# EAGLE design power_board2_v2.0 (EAGLE 9.5.1)
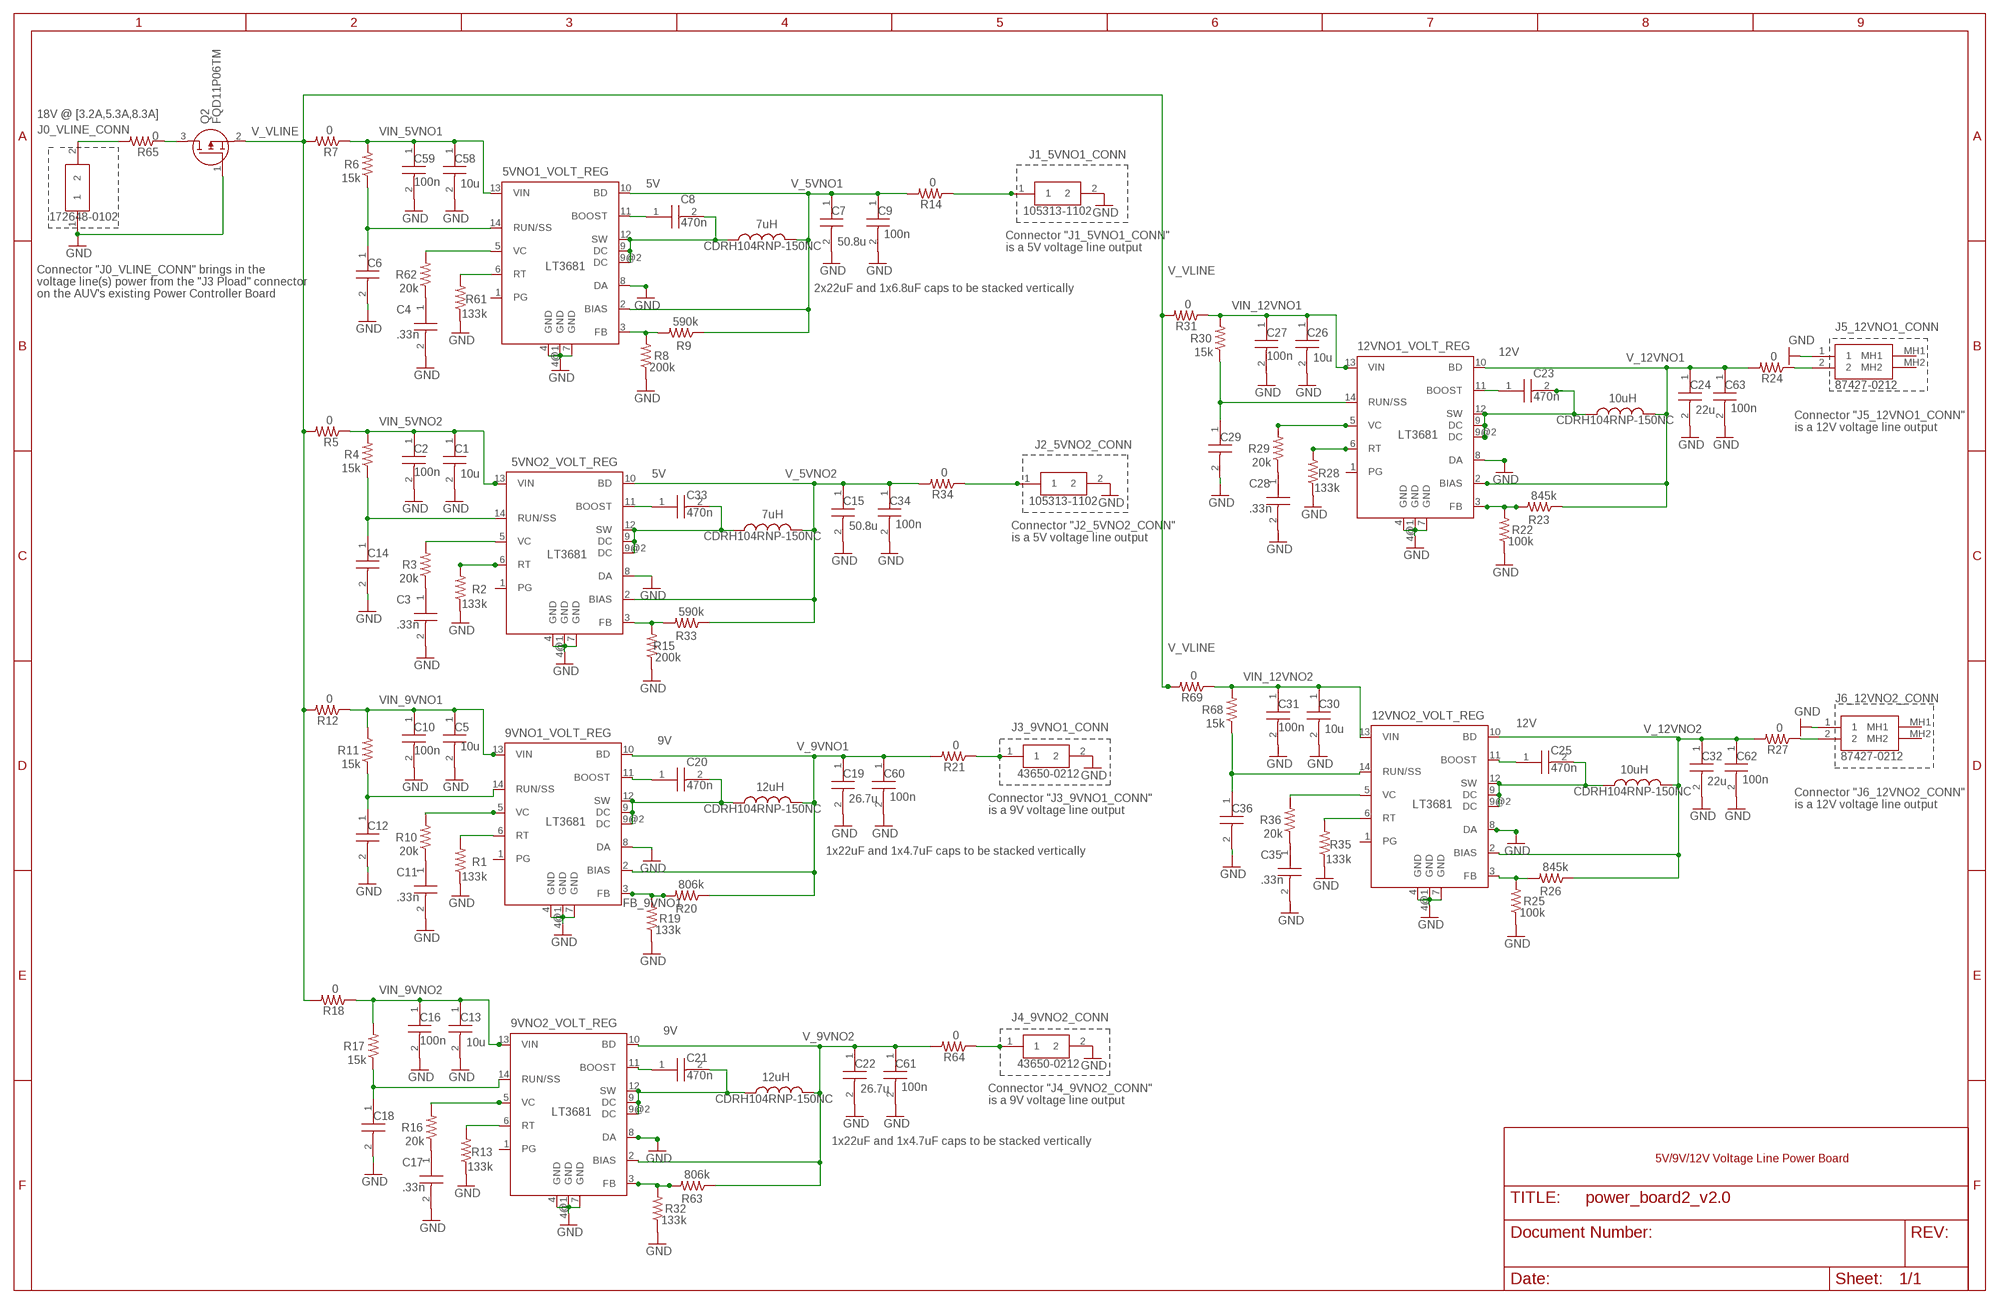
[diagram p0: schematic, sheet 1]

## Parts
5VNO1_VOLT_REG  LT3681  [DFN14-4X3DE]
5VNO2_VOLT_REG  LT3681  [DFN14-4X3DE]
9VNO1_VOLT_REG  LT3681  [DFN14-4X3DE]
9VNO2_VOLT_REG  LT3681  [DFN14-4X3DE]
12VNO1_VOLT_REG  LT3681  [DFN14-4X3DE]
12VNO2_VOLT_REG  LT3681  [DFN14-4X3DE]
C1  10u  22201C106KAT2A  [CAPC5750X279N]
C2  100n  06031C104KAT2A  [CAPC1608X90N]
C3  .33n  08053C334KAT2A  [CAPC2012X140N]
C4  .33n  08053C334KAT2A  [CAPC2012X140N]
C5  10u  22201C106KAT2A  [CAPC5750X279N]
C6  220n  08051C224KAT2A  [CAPC2012X140N]
C7  50.8u  12103C226KAT2A  [CAPC3225X279N]
C8  470n  06033C474JAT2A  [CAPC1608X90N]
C9  100n  06033C104KAT4A  [CAPC1608X90N]
C10  100n  06031C104KAT2A  [CAPC1608X90N]
C11  .33n  08053C334KAT2A  [CAPC2012X140N]
C12  220n  08051C224KAT2A  [CAPC2012X140N]
C13  10u  22201C106KAT2A  [CAPC5750X279N]
C14  220n  08051C224KAT2A  [CAPC2012X140N]
C15  50.8u  12103C226KAT2A  [CAPC3225X279N]
C16  100n  06031C104KAT2A  [CAPC1608X90N]
C17  .33n  08053C334KAT2A  [CAPC2012X140N]
C18  220n  08051C224KAT2A  [CAPC2012X140N]
C19  26.7u  12103C226KAT2A  [CAPC3225X279N]
C20  470n  06033C474JAT2A  [CAPC1608X90N]
C21  470n  06033C474JAT2A  [CAPC1608X90N]
C22  26.7u  12103C226KAT2A  [CAPC3225X279N]
C23  470n  06033C474JAT2A  [CAPC1608X90N]
C24  22u  12103C226KAT2A  [CAPC3225X279N]
C25  470n  06033C474JAT2A  [CAPC1608X90N]
C26  10u  22201C106KAT2A  [CAPC5750X279N]
C27  100n  06031C104KAT2A  [CAPC1608X90N]
C28  .33n  08053C334KAT2A  [CAPC2012X140N]
C29  220n  08051C224KAT2A  [CAPC2012X140N]
C30  10u  22201C106KAT2A  [CAPC5750X279N]
C31  100n  06031C104KAT2A  [CAPC1608X90N]
C32  22u  12103C226KAT2A  [CAPC3225X279N]
C33  470n  06033C474JAT2A  [CAPC1608X90N]
C34  100n  06033C104KAT4A  [CAPC1608X90N]
C35  .33n  08053C334KAT2A  [CAPC2012X140N]
C36  220n  08051C224KAT2A  [CAPC2012X140N]
C58  10u  22201C106KAT2A  [CAPC5750X279N]
C59  100n  06031C104KAT2A  [CAPC1608X90N]
C60  100n  06033C104KAT4A  [CAPC1608X90N]
C61  100n  06033C104KAT4A  [CAPC1608X90N]
C62  100n  06033C104KAT4A  [CAPC1608X90N]
C63  100n  06033C104KAT4A  [CAPC1608X90N]
INDUCTOR_2  CDRH104RNP-150NC  [INDPM102100X400N]
INDUCTOR_4  CDRH104RNP-150NC  [INDPM102100X400N]
INDUCTOR_5  CDRH104RNP-150NC  [INDPM102100X400N]
INDUCTOR_6  CDRH104RNP-150NC  [INDPM102100X400N]
INDUCTOR_7  CDRH104RNP-150NC  [INDPM102100X400N]
INDUCTOR_8  CDRH104RNP-150NC  [INDPM102100X400N]
J0_VLINE_CONN  172648-0102  [1726480102]
J1_5VNO1_CONN  105313-1102  [1053131102]
J2_5VNO2_CONN  105313-1102  [1053131102]
J3_9VNO1_CONN  43650-0212  [43650-0214]
J4_9VNO2_CONN  43650-0212  [43650-0214]
J5_12VNO1_CONN  87427-0212  [874270212]
J6_12VNO2_CONN  87427-0212  [874270212]
Q2  FQD11P06TM  [DPAK3-CASE-369AS]
R1  133k  R-US_R0603  [R0603]
R2  133k  R-US_R0603  [R0603]
R3  20k  R-US_R0603  [R0603]
R4  15k  R-US_R0603  [R0603]
R5  0  R-US_0207/2V  [0207/2V]
R6  15k  R-US_R0603  [R0603]
R7  0  R-US_0207/2V  [0207/2V]
R8  200k  R-US_R0603  [R0603]
R9  590k  R-US_R0603  [R0603]
R10  20k  R-US_R0603  [R0603]
R11  15k  R-US_R0603  [R0603]
R12  0  R-US_0207/2V  [0207/2V]
R13  133k  R-US_R0603  [R0603]
R14  0  R-US_0207/2V  [0207/2V]
R15  200k  R-US_R0603  [R0603]
R16  20k  R-US_R0603  [R0603]
R17  15k  R-US_R0603  [R0603]
R18  0  R-US_0207/2V  [0207/2V]
R19  133k  R-US_R0603  [R0603]
R20  806k  R-US_R0603  [R0603]
R21  0  R-US_0207/2V  [0207/2V]
R22  100k  R-US_R0603  [R0603]
R23  845k  R-US_R0603  [R0603]
R24  0  R-US_0207/2V  [0207/2V]
R25  100k  R-US_R0603  [R0603]
R26  845k  R-US_R0603  [R0603]
R27  0  R-US_0207/2V  [0207/2V]
R28  133k  R-US_R0603  [R0603]
R29  20k  R-US_R0603  [R0603]
R30  15k  R-US_R0603  [R0603]
R31  0  R-US_0207/2V  [0207/2V]
R32  133k  R-US_R0603  [R0603]
R33  590k  R-US_R0603  [R0603]
R34  0  R-US_0207/2V  [0207/2V]
R35  133k  R-US_R0603  [R0603]
R36  20k  R-US_R0603  [R0603]
R61  133k  R-US_R0603  [R0603]
R62  20k  R-US_R0603  [R0603]
R63  806k  R-US_R0603  [R0603]
R64  0  R-US_0207/2V  [0207/2V]
R65  0  R-US_0207/2V  [0207/2V]
R68  15k  R-US_R0603  [R0603]
R69  0  R-US_0207/2V  [0207/2V]

## Nets
CBOOST_5VNO1: 5VNO1_VOLT_REG.11(BOOST) C8.1
CBOOST_5VNO2: 5VNO2_VOLT_REG.11(BOOST) C33.1
CBOOST_9VNO1: 9VNO1_VOLT_REG.11(BOOST) C20.1
CBOOST_9VNO2: 9VNO2_VOLT_REG.11(BOOST) C21.1
CBOOST_12VNO1: 12VNO1_VOLT_REG.11(BOOST) C23.1
CBOOST_12VNO2: 12VNO2_VOLT_REG.11(BOOST) C25.1
FB_5VNO1: 5VNO1_VOLT_REG.3(FB) R8.2 R9.2
FB_5VNO2: 5VNO2_VOLT_REG.3(FB) R15.2 R33.2
FB_9VNO1: 9VNO1_VOLT_REG.3(FB) R19.2 R20.2
FB_9VNO2: 9VNO2_VOLT_REG.3(FB) R32.2 R63.2
FB_12VNO1: 12VNO1_VOLT_REG.3(FB) R22.2 R23.2
FB_12VNO2: 12VNO2_VOLT_REG.3(FB) R25.2 R26.2
GND: 5VNO1_VOLT_REG.4(GND) 5VNO1_VOLT_REG.4@1(GND) 5VNO1_VOLT_REG.7(GND) 5VNO1_VOLT_REG.8(DA) 5VNO2_VOLT_REG.4(GND) 5VNO2_VOLT_REG.4@1(GND) 5VNO2_VOLT_REG.7(GND) 5VNO2_VOLT_REG.8(DA) 9VNO1_VOLT_REG.4(GND) 9VNO1_VOLT_REG.4@1(GND) 9VNO1_VOLT_REG.7(GND) 9VNO1_VOLT_REG.8(DA) 9VNO2_VOLT_REG.4(GND) 9VNO2_VOLT_REG.4@1(GND) 9VNO2_VOLT_REG.7(GND) 9VNO2_VOLT_REG.8(DA) 12VNO1_VOLT_REG.4(GND) 12VNO1_VOLT_REG.4@1(GND) 12VNO1_VOLT_REG.7(GND) 12VNO1_VOLT_REG.8(DA) 12VNO2_VOLT_REG.4(GND) 12VNO2_VOLT_REG.4@1(GND) 12VNO2_VOLT_REG.7(GND) C1.2 C2.2 C3.2 C4.2 C5.2 C6.2 C7.2 C9.2 C10.2 C11.2 C12.2 C13.2 C14.2 C15.2 C16.2 C17.2 C18.2 C19.2 C22.2 C24.2 C26.2 C27.2 C28.2 C29.2 C30.2 C31.2 C32.2 C34.2 C35.2 C36.2 C58.2 C59.2 C60.2 C61.2 C62.2 C63.2 J0_VLINE_CONN.1 J1_5VNO1_CONN.2 J2_5VNO2_CONN.2 J3_9VNO1_CONN.2 J4_9VNO2_CONN.2 J5_12VNO1_CONN.1 J6_12VNO2_CONN.1 Q2.1(G) R1.1 R2.1 R8.1 R13.1 R15.1 R19.1 R22.1 R25.1 R28.1 R32.1 R35.1 R61.1
N$1: C4.1 R62.1
N$4: C3.1 R3.1
N$5: C11.1 R10.1
N$6: C17.1 R16.1
N$17: C28.1 R29.1
N$18: C35.1 R36.1
RT_5VNO1: 5VNO1_VOLT_REG.6(RT) R61.2
RT_5VNO2: 5VNO2_VOLT_REG.6(RT) R2.2
RT_9VNO1: 9VNO1_VOLT_REG.6(RT) R1.2
RT_9VNO2: 9VNO2_VOLT_REG.6(RT) R13.2
RT_12VNO1: 12VNO1_VOLT_REG.6(RT) R28.2
RT_12VNO2: 12VNO2_VOLT_REG.6(RT) R35.2
RUN/SS_5VNO1: 5VNO1_VOLT_REG.14(RUN/SS) C6.1 R6.1
RUN/SS_5VNO2: 5VNO2_VOLT_REG.14(RUN/SS) C14.1 R4.1
RUN/SS_9VNO1: 9VNO1_VOLT_REG.14(RUN/SS) C12.1 R11.1
RUN/SS_9VNO2: 9VNO2_VOLT_REG.14(RUN/SS) C18.1 R17.1
RUN/SS_12VNO1: 12VNO1_VOLT_REG.14(RUN/SS) C29.1 R30.1
RUN/SS_12VNO2: 12VNO2_VOLT_REG.14(RUN/SS) C36.1 R68.1
SW_5VNO1: 5VNO1_VOLT_REG.9(DC) 5VNO1_VOLT_REG.9@2(DC) 5VNO1_VOLT_REG.12(SW) C8.2 INDUCTOR_2.1
SW_5VNO2: 5VNO2_VOLT_REG.9(DC) 5VNO2_VOLT_REG.9@2(DC) 5VNO2_VOLT_REG.12(SW) C33.2 INDUCTOR_4.1
SW_9VNO1: 9VNO1_VOLT_REG.9(DC) 9VNO1_VOLT_REG.9@2(DC) 9VNO1_VOLT_REG.12(SW) C20.2 INDUCTOR_5.1
SW_9VNO2: 9VNO2_VOLT_REG.9(DC) 9VNO2_VOLT_REG.9@2(DC) 9VNO2_VOLT_REG.12(SW) C21.2 INDUCTOR_6.1
SW_12VNO1: 12VNO1_VOLT_REG.9(DC) 12VNO1_VOLT_REG.9@2(DC) 12VNO1_VOLT_REG.12(SW) C23.2 INDUCTOR_7.1
SW_12VNO2: 12VNO2_VOLT_REG.9(DC) 12VNO2_VOLT_REG.9@2(DC) 12VNO2_VOLT_REG.12(SW) C25.2 INDUCTOR_8.1
V_5VNO1: 5VNO1_VOLT_REG.2(BIAS) 5VNO1_VOLT_REG.10(BD) C7.1 C9.1 INDUCTOR_2.2 R9.1 R14.2
V_5VNO1_0: J1_5VNO1_CONN.1 R14.1
V_5VNO2: 5VNO2_VOLT_REG.2(BIAS) 5VNO2_VOLT_REG.10(BD) C15.1 C34.1 INDUCTOR_4.2 R33.1 R34.2
V_5VNO2_0: J2_5VNO2_CONN.1 R34.1
V_9VNO1: 9VNO1_VOLT_REG.2(BIAS) 9VNO1_VOLT_REG.10(BD) C19.1 C60.1 INDUCTOR_5.2 R20.1 R21.2
V_9VNO1_0: J3_9VNO1_CONN.1 R21.1
V_9VNO2: 9VNO2_VOLT_REG.2(BIAS) 9VNO2_VOLT_REG.10(BD) C22.1 C61.1 INDUCTOR_6.2 R63.1 R64.2
V_9VNO2_0: J4_9VNO2_CONN.1 R64.1
V_12VNO1: 12VNO1_VOLT_REG.2(BIAS) 12VNO1_VOLT_REG.10(BD) C24.1 C63.1 INDUCTOR_7.2 R23.1 R24.2
V_12VNO1_0: J5_12VNO1_CONN.2 R24.1
V_12VNO2: 12VNO2_VOLT_REG.2(BIAS) 12VNO2_VOLT_REG.10(BD) C32.1 C62.1 INDUCTOR_8.2 R26.1 R27.2
V_12VNO2_0: J6_12VNO2_CONN.2 R27.1
V_VLINE: Q2.2(S) R5.2 R7.2 R12.2 R18.2 R31.2 R69.2
V_VLINE00: J0_VLINE_CONN.2 R65.2
V_VLINE0: Q2.3(D) R65.1
VC_5VNO1: 5VNO1_VOLT_REG.5(VC) R62.2
VC_5VNO2: 5VNO2_VOLT_REG.5(VC) R3.2
VC_9VNO1: 9VNO1_VOLT_REG.5(VC) R10.2
VC_9VNO2: 9VNO2_VOLT_REG.5(VC) R16.2
VC_12VNO1: 12VNO1_VOLT_REG.5(VC) R29.2
VC_12VNO2: 12VNO2_VOLT_REG.5(VC) R36.2
VIN_5VNO1: 5VNO1_VOLT_REG.13(VIN) C58.1 C59.1 R6.2 R7.1
VIN_5VNO2: 5VNO2_VOLT_REG.13(VIN) C1.1 C2.1 R4.2 R5.1
VIN_9VNO1: 9VNO1_VOLT_REG.13(VIN) C5.1 C10.1 R11.2 R12.1
VIN_9VNO2: 9VNO2_VOLT_REG.13(VIN) C13.1 C16.1 R17.2 R18.1
VIN_12VNO1: 12VNO1_VOLT_REG.13(VIN) C26.1 C27.1 R30.2 R31.1
VIN_12VNO2: 12VNO2_VOLT_REG.13(VIN) C30.1 C31.1 R68.2 R69.1
Unconnected: 5VNO1_VOLT_REG.1(PG) 5VNO2_VOLT_REG.1(PG) 9VNO1_VOLT_REG.1(PG) 9VNO2_VOLT_REG.1(PG) 12VNO1_VOLT_REG.1(PG) 12VNO2_VOLT_REG.1(PG) 12VNO2_VOLT_REG.8(DA) J5_12VNO1_CONN.MH1 J5_12VNO1_CONN.MH2 J6_12VNO2_CONN.MH1 J6_12VNO2_CONN.MH2

## Notes on the sheet
- 18V @ [3.2A,5.3A,8.3A]
- J1_5VNO1_CONN
- 10u | 5V
- 7uH
- 50.8u
- Connector "J1_5VNO1_CONN"
  is a 5V voltage line output
- 2x22uF and 1x6.8uF caps to be stacked vertically
- Connector "J0_VLINE_CONN" brings in the
  voltage line(s) power from the "J3 Pload" connector
  on the AUV's existing Power Controller Board
- .33n
- 12V
- 10u
- 10uH
- 22u
- Connector "J5_12VNO1_CONN" 
  is a 12V voltage line output
- J2_5VNO2_CONN
- 10u | 5V
- .33n
- 7uH
- 50.8u
- Connector "J2_5VNO2_CONN"
  is a 5V voltage line output
- .33n
- 12V
- 10u
- 9V
- 10u
- 10uH
- 22u
- 12uH
- 26.7u
- Connector "J6_12VNO2_CONN" 
  is a 12V voltage line output
- Connector "J3_9VNO1_CONN" 
  is a 9V voltage line output
- 1x22uF and 1x4.7uF caps to be stacked vertically
- .33n
- .33n
- 9V
- 10u
- 12uH
- 26.7u
- Connector "J4_9VNO2_CONN"
  is a 9V voltage line output
- 1x22uF and 1x4.7uF caps to be stacked vertically
- 5V/9V/12V Voltage Line Power Board
- .33n

## Library data of the parts
5VNO1_VOLT_REG 5VNO2_VOLT_REG 9VNO1_VOLT_REG 9VNO2_VOLT_REG 12VNO1_VOLT_REG 12VNO2_VOLT_REG = linear-technology:LT3681: 36V, 2A, 2.8MHz Step-Down Switching Regulator with Integrated Power Schottky Diode Source: http://www.linear.com/pc/downloadDocument.do?navId=H0,C1,C1003,C1042,C1032,C1064,P38040,D25144; MPN: LT3681EDE#PBF; OC_FARNELL: 1627603; OC_NEWARK: 57M8550
C1 C5 C13 C26 C30 C58 = 22201C106KAT2A:22201C106KAT2A: Cap Ceramic 10uF 100V X7R 10% Pad SMD 2220 125C T/R Source: Datasheet <https://www.mouser.com/datasheet/2/40/X7RDielectric-777024.pdf>; DESCRIPTION: Cap Ceramic 10uF 100V X7R 10% Pad SMD 2220 125C T/R; HEIGHT: 2.79mm; MANUFACTURER_NAME: AVX; MANUFACTURER_PART_NUMBER: 22201C106KAT2A; MOUSER_PART_NUMBER: 581-22201C106KAT2A; MOUSER_PRICE-STOCK: https://www.mouser.com/Search/Refine.aspx?Keyword=581-22201C106KAT2A
C2 C10 C16 C27 C31 C59 = 06031C104KAT2A:06031C104KAT2A: AVX - 06031C104KAT2A - CAP, MLCC, X7R, 0.1UF, 100V, 0603 Source: Datasheet <https://componentsearchengine.com/Datasheets/1/06031A100FAT2A.pdf>; DESCRIPTION: AVX - 06031C104KAT2A - CAP, MLCC, X7R, 0.1UF, 100V, 0603; HEIGHT: 0.9mm; MANUFACTURER_NAME: AVX; MANUFACTURER_PART_NUMBER: 06031C104KAT2A; MOUSER_PART_NUMBER: 581-06031C104KAT2A; MOUSER_PRICE-STOCK: https://www.mouser.com/Search/Refine.aspx?Keyword=581-06031C104KAT2A
C3 C4 C11 C17 C28 C35 = 08053C334KAT2A:08053C334KAT2A: AVX 0805 Standard 0.33uF Ceramic Multilayer Capacitor, 25 V dc, +125 Source: Datasheet <http://datasheets.avx.com/X7RDielectric.pdf>; DESCRIPTION: AVX 0805 Standard 0.33uF Ceramic Multilayer Capacitor, 25 V dc, +125; HEIGHT: 1.4mm; MANUFACTURER_NAME: AVX; MANUFACTURER_PART_NUMBER: 08053C334KAT2A; MOUSER_PART_NUMBER: 581-08053C334KAT2A; MOUSER_PRICE-STOCK: https://www.mouser.com/Search/Refine.aspx?Keyword=581-08053C334KAT2A; RS_PART_NUMBER: 1747387; RS_PRICE-STOCK: http://uk.rs-online.com/web/p/products/1747387
C6 C12 C14 C18 C29 C36 = 08051C224KAT2A:08051C224KAT2A: Cap Ceramic 0.22uF 100V X7R 10% Pad SMD 0805 125C T/R Source: Datasheet <https://www.mouser.com/datasheet/2/40/X7RDielectric-777024.pdf>; DESCRIPTION: Cap Ceramic 0.22uF 100V X7R 10% Pad SMD 0805 125C T/R; HEIGHT: 1.4mm; MANUFACTURER_NAME: AVX; MANUFACTURER_PART_NUMBER: 08051C224KAT2A; MOUSER_PART_NUMBER: 581-08051C224KAT2A; MOUSER_PRICE-STOCK: https://www.mouser.com/Search/Refine.aspx?Keyword=581-08051C224KAT2A
C7 C15 C19 C22 C24 C32 = 12103C226KAT2A:12103C226KAT2A: Multilayer Ceramic Capacitors MLCC - SMD/SMT 25V 22uF X7R 1210 0.1 Source: Datasheet <https://componentsearchengine.com/Datasheets/1/12103C226KAT2A.pdf>; DESCRIPTION: Multilayer Ceramic Capacitors MLCC - SMD/SMT 25V 22uF X7R 1210 0.1; HEIGHT: 2.79mm; MANUFACTURER_NAME: AVX; MANUFACTURER_PART_NUMBER: 12103C226KAT2A; MOUSER_PART_NUMBER: 581-12103C226KAT2A; MOUSER_PRICE-STOCK: https://www.mouser.com/Search/Refine.aspx?Keyword=581-12103C226KAT2A
C8 C20 C21 C23 C25 C33 = 06033C474JAT2A:06033C474JAT2A: Multilayer Ceramic Capacitors MLCC - SMD/SMT 25V 470nF X7R 0603 +5% Source: Datasheet <https://componentsearchengine.com/Datasheets/1/06031A100FAT2A.pdf>; DESCRIPTION: Multilayer Ceramic Capacitors MLCC - SMD/SMT 25V 470nF X7R 0603 +5%; HEIGHT: 0.9mm; MANUFACTURER_NAME: AVX; MANUFACTURER_PART_NUMBER: 06033C474JAT2A; MOUSER_PART_NUMBER: 581-06033C474JAT2A; MOUSER_PRICE-STOCK: https://www.mouser.com/Search/Refine.aspx?Keyword=581-06033C474JAT2A
C9 C34 C60-C63 = 06033C104KAT4A:06033C104KAT4A: Multilayer Ceramic Capacitors MLCC - SMD/SMT 25volts 0.1uF 10% X7R Source: Datasheet <http://www.mouser.com/catalog/supplier/library/pdf/AVXSurfaceMountCeramic.pdf>; DESCRIPTION: Multilayer Ceramic Capacitors MLCC - SMD/SMT 25volts 0.1uF 10% X7R; HEIGHT: 0.9mm; MANUFACTURER_NAME: AVX; MANUFACTURER_PART_NUMBER: 06033C104KAT4A; MOUSER_PART_NUMBER: 581-06033C104KAT4A; MOUSER_PRICE-STOCK: https://www.mouser.com/Search/Refine.aspx?Keyword=581-06033C104KAT4A
INDUCTOR_2 INDUCTOR_4-INDUCTOR_8 = CDRH104RNP-150NC:CDRH104RNP-150NC: Fixed Inductors 15uH 3.1A Source: Datasheet <http://products.sumida.com/products/pdf/CDRH104R.pdf>; DESCRIPTION: Fixed Inductors 15uH 3.1A; HEIGHT: 4mm; MANUFACTURER_NAME: Sumida; MANUFACTURER_PART_NUMBER: CDRH104RNP-150NC; MOUSER_PART_NUMBER: 851-CDRH104RNP-150NC; MOUSER_PRICE-STOCK: https://www.mouser.com/Search/Refine.aspx?Keyword=851-CDRH104RNP-150NC
J0_VLINE_CONN = 172648-0102:172648-0102: Board to Board & Mezzanine Connectors Source: Datasheet <https://www.molex.com/pdm_docs/sd/1726480102_sd.pdf>; DESCRIPTION: Board to Board & Mezzanine Connectors; HEIGHT: 5.4mm; MANUFACTURER_NAME: Molex; MANUFACTURER_PART_NUMBER: 172648-0102; MOUSER_PART_NUMBER: 538-172648-0102; MOUSER_PRICE-STOCK: https://www.mouser.com/Search/Refine.aspx?Keyword=538-172648-0102
J1_5VNO1_CONN J2_5VNO2_CONN = 105313-1102:105313-1102: Molex Nano-Fit 105313, 2.5mm Pitch, 2 Way, 1 Row, Right Angle PCB Header, Through Hole Source: Datasheet <https://www.molex.com/molex/products/datasheet.jsp?part=active/1053131102_PCB_HEADERS.xml&channel=Products&Lang=en-US>; DESCRIPTION: Molex Nano-Fit 105313, 2.5mm Pitch, 2 Way, 1 Row, Right Angle PCB Header, Through Hole; HEIGHT: 6.84mm; MANUFACTURER_NAME: Molex; MANUFACTURER_PART_NUMBER: 105313-1102; MOUSER_PART_NUMBER: 538-105313-1102; MOUSER_PRICE-STOCK: https://www.mouser.com/Search/Refine.aspx?Keyword=538-105313-1102; RS_PART_NUMBER: 1623686; RS_PRICE-STOCK: http://uk.rs-online.com/web/p/products/1623686
J3_9VNO1_CONN J4_9VNO2_CONN = 43650-0212:43650-0212: Molex MICRO-FIT 3.0 Series, Series Number 43650, 3mm Pitch 2 Way 1 Row Shrouded Right Angle PCB Header, Surface Mount Source: Datasheet <https://componentsearchengine.com/Datasheets/2/43650-0212.pdf>; ALLIED_NUMBER: 70266892; ALLIED_PRICE-STOCK: https://www.alliedelec.com/molex-incorporated-43650-0212/70266892/; DESCRIPTION: Molex MICRO-FIT 3.0 Series, Series Number 43650, 3mm Pitch 2 Way 1 Row Shrouded Right Angle PCB Header, Surface Mount; HEIGHT: mm; MANUFACTURER_NAME: Molex; MANUFACTURER_PART_NUMBER: 43650-0212; MOUSER_PART_NUMBER: 538-43650-0212; MOUSER_PRICE-STOCK: https://www.mouser.com/Search/Refine.aspx?Keyword=538-43650-0212; RS_PART_NUMBER: 4476811P; RS_PRICE-STOCK: http://uk.rs-online.com/web/p/products/4476811P
J5_12VNO1_CONN J6_12VNO2_CONN = 87427-0212:87427-0212: Headers & Wire Housings Minifit Jr. Header ( Header (high temp.) Source: Datasheet <https://www.mouser.com/datasheet/2/276/0874270212_PCB_HEADERS-154227.pdf>; DESCRIPTION: Headers & Wire Housings Minifit Jr. Header ( Header (high temp.); HEIGHT: 10.2mm; MANUFACTURER_NAME: Molex; MANUFACTURER_PART_NUMBER: 87427-0212; MOUSER_PART_NUMBER: 538-87427-0212; MOUSER_PRICE-STOCK: https://www.mouser.com/Search/Refine.aspx?Keyword=538-87427-0212
Q2 = FQD11P06TM:FQD11P06TM: FQD11P06TM P-Channel MOSFET, 9.4 A, 60 V, 3-Pin DPAK ON Semiconductor Source: Datasheet <https://www.onsemi.com/pub/Collateral/FQU11P06-D.pdf>; DESCRIPTION: FQD11P06TM P-Channel MOSFET, 9.4 A, 60 V, 3-Pin DPAK ON Semiconductor; HEIGHT: mm; MANUFACTURER_NAME: ON Semiconductor; MANUFACTURER_PART_NUMBER: FQD11P06TM; MOUSER_PART_NUMBER: 512-FQD11P06TM; MOUSER_PRICE-STOCK: https://www.mouser.com/Search/Refine.aspx?Keyword=512-FQD11P06TM; RS_PART_NUMBER: 6710949P; RS_PRICE-STOCK: http://uk.rs-online.com/web/p/products/6710949P
R1-R4 R6 R8-R11 R13 R15-R17 R19 R20 R22 R23 R25 R26 R28-R30 R32 R33 R35 R36 R61-R63 R68 = rcl:R-US_: RESISTOR, American symbol; SPICEPREFIX: R
R5 R7 R12 R14 R18 R21 R24 R27 R31 R34 R64 R65 R69 = rcl:R-US_: RESISTOR, American symbol; DESC: RES SMD 10K OHM 1% 1/8W 0805; MFR: Yageo; MPN: RC0805FR-0710KL; SPICEPREFIX: R

## Board
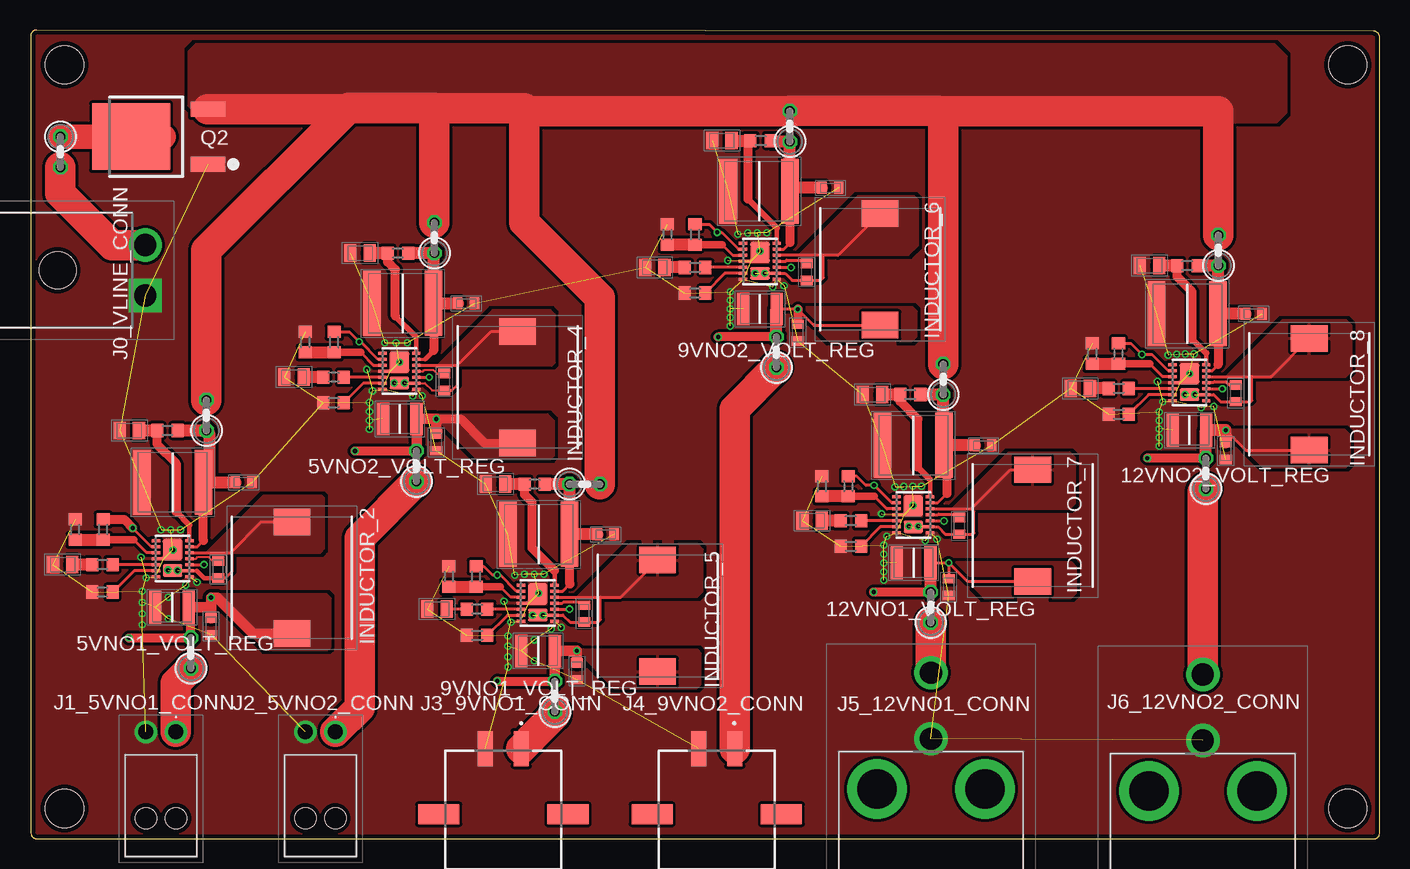
[diagram p1: board, top side]
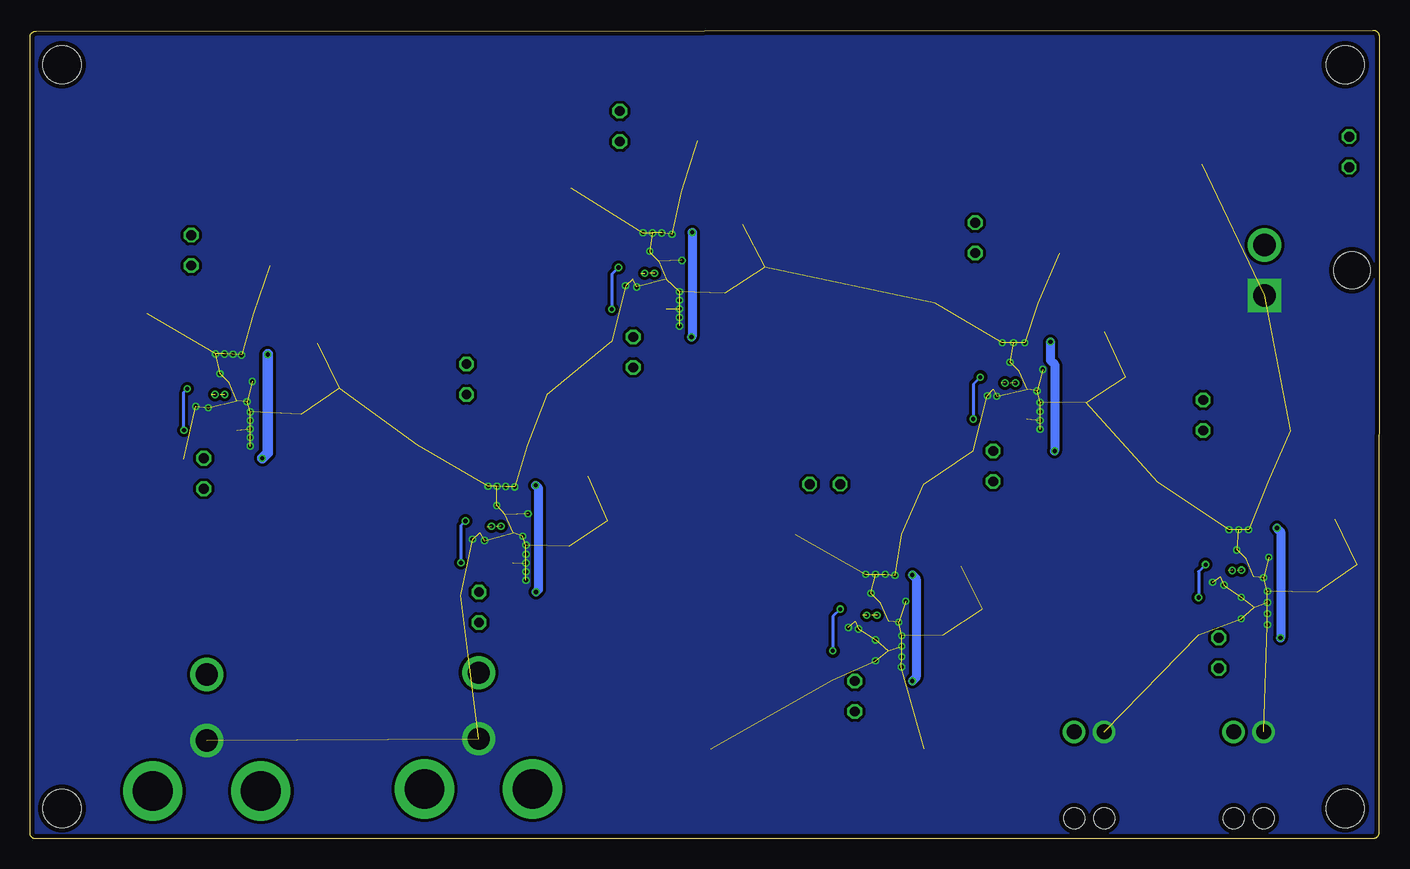
[diagram p2: board, bottom side, seen from below]

Size 112.42 x 67.41 mm. Coordinates in mm from the lower left corner, seen from the top.
Outline: 111.91,67.31 0.51,67.41 arc90 0,66.91 0.03,0.51 arc90 0.53,0 111.91,0 arc90 112.42,0.51 112.42,66.8 arc90 111.91,67.31
Copper layers (1*16): Top 0.035559375mm / dielectric 1.6mm / Bottom 0.035559375mm
Design rules "oshpark-2layer": minimum track width 6mil, minimum drill 10mil, track to track 6mil, track to pad 6mil, pad to pad 6mil, via to via 6mil, smd to smd 6mil, copper to edge 15mil, drill to drill 6mil, minimum pad ring 5mil, minimum via ring 5mil, stop-mask expansion 2.5mil, vias tented up to drill 0mil, thermal gap 10mil
Holes 3.17 mm at 109.75,64.52 109.75,2.54 2.82,2.54 2.82,64.52

### Footprints (pad centres in the part's own frame; a part is rotated, then mirrored left to right if it is on the bottom)
DFN14-4X3DE = smd 0.25 x 0.7: 1 -1.5,-1.4; 2 -1,-1.4; 3 -0.5,-1.4; 5 0.5,-1.4; 6 1,-1.4; 7 1.5,-1.4; 8 1.5,1.4; 10 0.5,1.4; 11 0,1.4; 12 -0.5,1.4; 13 -1,1.4; 14 -1.5,1.4 | smd 0.25 x 2: 4 0,-0.75; 9 1,0.75 | smd 1.75 x 1.65: 4@1 -0.75,0 | smd 1.07 x 1.65: 9@2 1,0
CAPC5750X279N = smd 1.47 x 5.41: 1 -2.57,0; 2 2.57,0
CAPC1608X90N = smd 0.78 x 0.99: 1 -0.7,0; 2 0.7,0
CAPC2012X140N = smd 1.02 x 1.47: 1 -0.81,0; 2 0.81,0
CAPC3225X279N = smd 1.02 x 2.72: 1 -1.4,0; 2 1.4,0
INDPM102100X400N = smd 2.2 x 3.05: 1 -4.65,0; 2 4.65,0
1726480102 = drill 1.85 pad 2.775 square: 1 0,0 | drill 1.85 pad 2.775: 2 -4.2,0 | hole 3.05: -2.1,-7.3
1053131102 = drill 1.25 pad 1.875: 1 0,0; 2 -2.5,0 | hole 1.75: 0,-7.18; -2.5,-7.18
43650-0214 = smd 1.27 x 2.92: 1 1.5,10.07; 2 -1.5,10.07 | smd 3.43 x 1.65: 3 -5.385,4.6; 4 5.385,4.6
874270212 = drill 1.85 pad 2.775: 1 0,0; 2 0,5.5 | drill 3.3 pad 4.95: MH1 -4.5,-4.2; MH2 4.5,-4.2
DPAK3-CASE-369AS = smd 1.25 x 2.85: 1 -2.28,-6.4; 2 2.28,-6.4 | smd 5.55 x 6.5: 3 0,0
R0603 = smd 1 x 1.1: 1 -0.85,0; 2 0.85,0
0207/2V = drill 0.813 octagon: 1 -1.27,0; 2 1.27,0

### Placement (x,y rotation side)
5VNO1_VOLT_REG  11.84,23.37 270 top
5VNO2_VOLT_REG  30.73,38.99 270 top
9VNO1_VOLT_REG  42.27,19.66 270 top
9VNO2_VOLT_REG  60.78,48.13 270 top
12VNO1_VOLT_REG  73.56,27 270 top
12VNO2_VOLT_REG  96.57,38.02 270 top
C1  31.01,44.63 180 top
C2  36.3,44.63 0 top
C3  21.95,38.48 180 top
C4  2.67,22.86 180 top
C5  42.34,25.37 180 top
C6  8.23,34.04 180 top
C7  11.79,19.3 180 top
C8  15.62,22.45 270 top
C9  15.04,17.7 270 top
C10  47.93,25.37 0 top
C11  33.86,19.15 180 top
C12  38.73,29.57 180 top
C13  60.71,53.98 180 top
C14  27.46,48.82 180 top
C15  30.76,35 180 top
C16  66.65,54.25 0 top
C17  52.02,47.62 180 top
C18  57.61,58.19 180 top
C19  42.29,15.67 180 top
C20  46.13,18.77 270 top
C21  64.67,47.24 270 top
C22  60.78,44.17 180 top
C23  77.39,26.09 270 top
C24  73.58,23.01 180 top
C25  100.43,37.13 270 top
C26  73.56,32.79 180 top
C27  79.4,32.79 0 top
C28  65.13,26.52 180 top
C29  70.15,37.03 180 top
C30  96.39,43.76 180 top
C31  101.93,43.76 0 top
C32  96.57,34.06 180 top
C33  34.47,38.07 270 top
C34  33.81,33.05 270 top
C35  87.48,37.54 180 top
C36  93.24,47.78 180 top
C58  11.84,29.72 180 top
C59  17.75,29.72 0 top
C60  45.52,13.97 270 top
C61  63.93,42.19 270 top
C62  99.59,32.33 270 top
C63  76.5,20.98 270 top
INDUCTOR_2  21.77,21.77 270 top
INDUCTOR_4  40.59,37.64 270 top
INDUCTOR_5  52.25,18.59 270 top
INDUCTOR_6  70.79,47.47 270 top
INDUCTOR_7  83.52,26.11 270 top
INDUCTOR_8  106.55,37.06 270 top
J0_VLINE_CONN  9.55,45.29 270 top
J1_5VNO1_CONN  12.12,8.92 0 top
J2_5VNO2_CONN  25.4,8.92 0 top
J3_9VNO1_CONN  39.4,-2.54 0 top
J4_9VNO2_CONN  57.18,-2.54 0 top
J5_12VNO1_CONN  75.03,8.36 0 top
J6_12VNO2_CONN  97.69,8.2 0 top
Q2  8.38,58.52 90 top
R1  37.21,16.97 0 top
R2  25.25,36.35 0 top
R3  25.25,38.48 0 top
R4  30.61,48.82 0 top
R5  33.65,50.09 90 top
R6  11.4,34.04 0 top
R7  14.66,35.31 90 top
R8  3.71,25.78 270 top
R9  6.05,25.78 270 top
R10  37.21,19.15 0 top
R11  42.01,29.57 0 top
R12  46.18,29.57 0 top
R13  55.37,45.49 0 top
R14  13.36,15.49 90 top
R15  22.89,41.4 270 top
R16  55.37,47.62 0 top
R17  60.83,58.19 0 top
R18  63.27,59.39 90 top
R19  34.85,21.87 270 top
R20  37.13,21.87 270 top
R21  43.69,11.89 90 top
R22  65.94,29.39 270 top
R23  68.15,29.39 270 top
R24  75.01,19.3 90 top
R25  88.47,40.44 270 top
R26  90.65,40.44 270 top
R27  97.94,30.45 90 top
R28  68.35,24.38 0 top
R29  68.35,26.52 0 top
R30  73.3,37.03 0 top
R31  76.05,38.3 90 top
R32  53.06,50.37 270 top
R33  25.3,41.4 270 top
R34  32.16,31.06 90 top
R35  90.68,35.38 0 top
R36  90.68,37.54 0 top
R61  5.99,20.57 0 top
R62  5.99,22.86 0 top
R63  55.37,50.37 270 top
R64  62.15,40.56 90 top
R65  2.49,57.25 270 top
R68  96.39,47.78 0 top
R69  98.98,49.05 90 top

### Tracks (layer width: path | path; a pad name or v marks a point on that pad's centre or on a via)
CBOOST_5VNO1
  Top 0.152: C8.1 15.16,23.15 14.81,23.51 13.94,23.51 13.79,23.37 5VNO1_VOLT_REG.11
CBOOST_5VNO2
  Top 0.152: 5VNO2_VOLT_REG.11 32.72,38.99 32.82,39.09 33.57,39.09 33.88,38.77 C33.1
CBOOST_9VNO1
  Top 0.254: 9VNO1_VOLT_REG.11 44.32,19.66 44.42,19.75 45.84,19.75 C20.1
CBOOST_9VNO2
  Top 0.254: 9VNO2_VOLT_REG.11 62.89,48.13 62.98,48.23 64.39,48.23 C21.1
CBOOST_12VNO1
  Top 0.254: 12VNO1_VOLT_REG.11 75.57,27 75.64,27.08 77.1,27.08 C23.1
CBOOST_12VNO2
  Top 0.254: 12VNO2_VOLT_REG.11 98.56,38.02 98.65,38.12 99.62,38.12 99.9,37.84 C25.1
FB_5VNO1
  Top 0.254: 5VNO1_VOLT_REG.3 9.66,23.87 8.6,24.93
  Top 0.635: 8.6,24.93 R9.2
  Top 1.016: R8.2 R9.2
FB_5VNO2
  Top 0.254: 5VNO2_VOLT_REG.3 28.56,39.49 27.49,40.55
  Top 0.635: R33.2 27.49,40.55
  Top 1.016: R15.2 R33.2
FB_9VNO1
  Top 0.254: 9VNO1_VOLT_REG.3 40.01,20.16 39.15,21.02
  Top 0.635: 39.15,21.02 R20.2
  Top 1.016: R19.2 R20.2
FB_9VNO2
  Top 0.254: 9VNO2_VOLT_REG.3 58.53,48.63 57.64,49.52
  Top 0.635: R63.2 57.64,49.52
  Top 1.016: R63.2 R32.2
FB_12VNO1
  Top 0.254: 12VNO1_VOLT_REG.3 71.36,27.5 70.32,28.54
  Top 0.635: 70.32,28.54 R23.2
  Top 1.016: R23.2 R22.2
FB_12VNO2
  Top 0.254: 12VNO2_VOLT_REG.3 94.34,38.52 93.27,39.6 | R26.2
  Top 0.635: 93.27,39.6 R26.2
  Top 1.016: R25.2 R26.2
GND  (via drill 0.35)  (160 unrouted)
  other vias: 10.87,25.76 11.68,25.76 12.5,25.76 9.63,21.77 9.19,23.47 9.3,20.65 9.3,19.71 9.3,18.77 9.3,17.86 13.87,21.39 12.93,21.16 11.48,20.14 11.48,18.34 28.02,39.12 32.64,36.93 31.85,36.88 28.5,37.34 28.24,36.37 28.24,35.61 28.24,34.87 28.24,34.14 31.39,41.35 30.45,41.35 29.51,41.35 39.45,19.81 44.22,17.63 43.38,17.5 42.77,22.05 41.96,22.05 41.15,22.05 40.34,21.97 39.78,16.94 39.78,16.05 39.78,15.19 39.8,14.33 41.96,16.59 41.96,14.86 40.03,18.06 58.09,48.21 62.79,46.1 61.85,46 58.29,45.59 58.29,44.88 58.29,44.17 58.29,43.46 58.29,42.75 61.34,50.52 60.55,50.5 59.77,50.5 58.93,50.39 71.35,25.22 70.92,27.1 74.55,24.87 75.54,24.97 71.09,24.49 71.09,23.72 71.09,22.99 71.09,22.28 71.09,21.56 74.24,29.39 73.51,29.39 72.77,29.36 72.03,29.34 93.9,38.13 98.6,36.04 97.56,35.94 94.34,36.42 96.95,40.41 96.22,40.41 95.5,40.39 94.79,40.34 94.06,35.59 94.06,34.87 94.06,34.16 94.06,33.45 94.06,32.74 30.76,39.73 11.86,24.08 42.34,20.47 73.53,27.79 60.78,48.97 96.6,38.76
  pour Top (isolate 0.254, rank 6, no thermals): -0.03,67.56 -0.03,-0.1 112.57,-0.1 112.57,67.56
  pour Bottom (isolate 0.254, rank 6, no thermals): -0.05,67.51 -0.05,-0.13 112.57,-0.13 112.57,67.51
N$1
  Top 1.016: R62.1 C4.1
N$4
  Top 1.016: R3.1 C3.1
N$5
  Top 0.254: R10.1 C11.1
N$6
  Top 1.016: R16.1 C17.1
N$17
  Top 1.016: R29.1 C28.1
N$18
  Top 1.016: R36.1 C35.1
RT_5VNO1
  Top 0.254: 5VNO1_VOLT_REG.6 8.64,22.37 R61.2
RT_5VNO2
  Top 0.254: 5VNO2_VOLT_REG.6 27.74,37.99 R2.2
RT_9VNO1
  Top 0.254: R1.2 39.75,18.66 9VNO1_VOLT_REG.6
RT_9VNO2
  Top 0.254: 9VNO2_VOLT_REG.6 57.86,47.13 R13.2
RT_12VNO1
  Top 0.254: 12VNO1_VOLT_REG.6 70.82,26 R28.2
RT_12VNO2
  Top 0.254: 12VNO2_VOLT_REG.6 93.17,37.02 R35.2
RUN/SS_5VNO1
  Top 0.381: 5VNO1_VOLT_REG.14 13.24,26.16
  Top 0.508: 13.24,26.16 12.13,27.27
  Top 0.762: 12.13,27.27 12.13,31.29 10.55,32.87 R6.1
  Top 1.016: R6.1 C6.1
RUN/SS_5VNO2
  Top 0.381: 5VNO2_VOLT_REG.14 32.13,41.83
  Top 0.508: 32.13,41.83 30.4,43.56
  Top 0.762: R4.1 29.76,48.09 30.4,47.45 30.4,43.56
  Top 1.016: R4.1 C14.1
RUN/SS_9VNO1
  Top 0.381: 9VNO1_VOLT_REG.14 43.67,22.35
  Top 0.762: R11.1 41.16,28.69 41.78,28.07 41.78,24.23 43.67,22.35
  Top 1.016: R11.1 C12.1
RUN/SS_9VNO2
  Top 0.381: 9VNO2_VOLT_REG.14 62.18,50.92
  Top 0.508: 62.18,50.92 59.77,53.34
  Top 0.762: R17.1 59.77,57.98 59.77,53.34
  Top 1.016: C18.1 R17.1
RUN/SS_12VNO1
  Top 0.381: 12VNO1_VOLT_REG.14 74.96,29.94 | 73.91,34.72 73.94,34.75 73.94,34.98
  Top 0.508: 74.96,29.94 73.91,30.99
  Top 0.762: 73.91,30.99 73.91,34.72 | R30.1 72.45,36.46 73.94,34.98
  Top 1.016: R30.1 C29.1
RUN/SS_12VNO2
  Top 0.381: 12VNO2_VOLT_REG.14 97.97,40.48
  Top 0.508: 97.97,40.48 96.8,41.66
  Top 0.762: 96.8,41.66 96.8,45.59 95.54,46.85 R68.1
  Top 1.016: R68.1 C36.1
SW_5VNO1  (via drill 0.35)  (2 unrouted)
  Top 0.254: 5VNO1_VOLT_REG.12 16.69,23.87 | 16.69,23.87 16.79,23.87 16.79,22.3 16.24,21.75 C8.2 15.61,21.74 | 16.69,23.87 19.24,26.42 INDUCTOR_2.1 | 13.85,22.37 5VNO1_VOLT_REG.9 5VNO1_VOLT_REG.9@2
  Top 0.381: 13.85,22.37 14.48,21.74 15.61,21.74
  other vias: 11.46,22.4 12.24,22.38
  pour Top (isolate 0.254, no thermals): 14.66,23.85 24.13,23.85 24.49,24.21 24.49,28.37 24.26,28.6 19.41,28.6
SW_5VNO2  (via drill 0.35)  (2 unrouted)
  Top 0.152: 5VNO2_VOLT_REG.9 32.85,37.99 33.47,37.38 C33.2
  Top 0.254: 5VNO2_VOLT_REG.12 35.59,39.49 | C33.2 35.11,37.38 35.59,37.85 35.59,39.49 | 35.59,39.49 35.59,39.5 38.38,42.29 INDUCTOR_4.1 | 5VNO2_VOLT_REG.9 5VNO2_VOLT_REG.9@2
  other vias: 30.3,38 31.17,38
  pour Top (isolate 0.254, no thermals): 33.91,39.47 43.46,39.47 43.69,39.7 43.69,43.69 43.31,44.07 38.51,44.07
SW_9VNO1  (via drill 0.35)  (2 unrouted)
  Top 0.254: 9VNO1_VOLT_REG.12 47.48,20.16 | 47.48,20.16 47.48,18.3 47.26,18.07 C20.2 44.96,18.06 44.36,18.66 9VNO1_VOLT_REG.9 9VNO1_VOLT_REG.9@2 | 47.48,20.16 49.16,20.16 INDUCTOR_5.1
  other vias: 41.83,18.64 42.7,18.64
  pour Top (isolate 0.254): 45.57,20.17 55.55,20.17 56.03,20.65 56.03,24.1 55.6,24.54 49.94,24.54
SW_9VNO2  (via drill 0.35)  (2 unrouted)
  Top 0.254: 66.06,48.63 66.06,46.78 65.82,46.54 C21.2 63.46,46.54 62.87,47.13 9VNO2_VOLT_REG.9 9VNO2_VOLT_REG.9@2 | 66.06,48.63 67.3,48.63 INDUCTOR_6.1 | 66.06,48.63 9VNO2_VOLT_REG.12
  other vias: 60.38,47.14 61.19,47.14
  pour Top (isolate 0.254, no thermals): 64.03,48.67 73.15,48.67 73.96,49.48 73.96,53.24 73.63,53.57 68.94,53.57
SW_12VNO1  (via drill 0.35)  (2 unrouted)
  Top 0.254: 12VNO1_VOLT_REG.12 78.39,27.5 | 78.39,27.5 78.61,27.28 78.61,25.48 78.52,25.39 C23.2 76.24,25.39 75.63,26 12VNO1_VOLT_REG.9 12VNO1_VOLT_REG.9@2 | 78.39,27.5 81.65,30.76 INDUCTOR_7.1
  other vias: 73.18,26.06 73.96,26.06
  pour Top (isolate 0.254): 76.78,27.51 86.59,27.51 87.07,27.99 87.07,31.75 86.64,32.18 81.46,32.18
SW_12VNO2  (via drill 0.35)  (2 unrouted)
  Top 0.254: 12VNO2_VOLT_REG.12 101.77,38.52 | 101.77,38.52 101.78,38.52 101.78,36.52 101.69,36.44 C25.2 99.18,36.44 98.59,37.02 12VNO2_VOLT_REG.9 12VNO2_VOLT_REG.9@2 | 101.77,38.52 103.37,38.52 INDUCTOR_8.1
  other vias: 96.19,37.03 97,37.03
  pour Top (isolate 0.254): 99.59,38.51 109.58,38.51 110.08,39.01 110.08,42.75 109.63,43.21 104.29,43.21
V_5VNO1  (via drill 0.35)
  Top 0.254: 5VNO1_VOLT_REG.2 10.05,24.37 v8.51,25.91 | 13.36,19.13 C7.1 | 5VNO1_VOLT_REG.10 v14.44,22.87 v14.45,22.86
  Top 0.762: 13.36,19.13 R14.2 13.34,16.79 13.31,16.76 v8.2,16.76 | v8.51,25.91 7.79,26.63 R9.1
  Top 0.889: INDUCTOR_2.2 18.54,17.12 15.54,20.12 v15.04,20.12 15.04,19.3 | C7.1 15.04,19.3 | 15.04,19.3 C9.1
  Bottom 0.254: v14.45,22.86 15.04,22.28 v15.04,20.12
  Bottom 0.762: v8.2,16.76 8.2,25.6 v8.51,25.91
  pour Top (isolate 0.254, no thermals): 14.94,20.4 19.58,15.75 24.71,15.75 24.99,16.03 24.99,20.07 24.66,20.4
V_5VNO1_0
  Top 2.54: J1_5VNO1_CONN.1 12.12,12.98 R14.1
V_5VNO2  (via drill 0.35)
  Top 0.254: 5VNO2_VOLT_REG.10 v33.22,38.49 v33.22,38.48 | R33.1 26.56,42.25 v27.38,41.43 27.51,41.43 28.95,39.99 5VNO2_VOLT_REG.2
  Top 0.762: R34.2 v27.03,32.33 | v33.81,35 35.84,35 37.85,32.99 INDUCTOR_4.2
  Top 0.889: C34.1 v33.81,35 C15.1 R34.2
  Bottom 0.254: v33.22,38.48 33.81,37.9 v33.81,35
  Bottom 0.762: v27.38,41.43 27.38,39.9 27.03,39.55 v27.03,32.33
  pour Top (isolate 0.254, no thermals): 33.83,35.03 37.19,31.67 43.36,31.67 43.64,31.95 43.64,34.82 43.1,35.36 33.83,35.36
V_5VNO2_0
  Top 2.54: R34.1 27.43,25.07 27.43,10.95 J2_5VNO2_CONN.1
V_9VN02
  pour Top (isolate 0.254, no thermals): 63.73,44.32 66.57,41.48 73.43,41.48 73.84,41.88 73.84,43.99 73.51,44.32
V_9VNO1  (via drill 0.35)
  Top 0.254: 9VNO1_VOLT_REG.10 v44.9,19.16 v44.91,19.15 | R20.1 37.76,22.72 38.48,22 v38.89,22 39.14,22 40.48,20.66 9VNO1_VOLT_REG.2 | R21.2
  Top 0.762: v38.89,13.16 R21.2
  Top 0.889: C60.1 v45.52,15.67 C19.1 R21.2
  Bottom 0.254: v44.91,19.15 45.52,18.54 v45.52,15.67
  Bottom 0.762: v38.89,13.16 38.58,13.46 38.58,21.69 v38.89,22
  pour Top (isolate 0.254): 45.47,15.75 48.64,12.57 55.5,12.57 55.83,12.9 55.83,15.49 55.58,15.75
V_9VNO1_0
  Top 2.54: J3_9VNO1_CONN.1 41.68,8.32 41.68,8.33 43.69,10.34 R21.1
V_9VNO2  (via drill 0.35)
  Top 0.254: 9VNO2_VOLT_REG.2 58.99,49.13 57.58,50.55 v57.23,50.55 56.55,51.22 R63.1 | 9VNO2_VOLT_REG.10 63.37,47.63 v63.37,47.62 | 62.16,44.15 C22.1 | 62.16,44.15 v63.93,44.15 65.23,42.85 65.23,42.82 INDUCTOR_6.2 | 62.16,44.15 62.15,44.14
  Top 0.762: R64.2 v57.3,41.83 | v63.93,44.15 C61.1
  Top 1.016: R64.2 62.15,44.14
  Bottom 0.254: v63.37,47.62 63.93,47.07 v63.93,44.15
  Bottom 0.762: v57.23,50.55 57.25,50.52 57.25,41.88 v57.3,41.83
V_9VNO2_0
  Top 2.54: R64.1 58.68,35.81 J4_9VNO2_CONN.1
V_12NO1
  pour Top (isolate 0.254): 76.5,23.04 79.45,20.09 86.72,20.09 87.15,20.52 87.15,22.63 86.74,23.04
V_12VNO1  (via drill 0.35)
  Top 0.254: 12VNO1_VOLT_REG.2 71.77,28 70.31,29.46 v70.28,29.46 69.61,29.46 68.83,30.24 R23.1 | C24.1 75.01,22.99 76.48,22.99 v76.5,23.01 | 12VNO1_VOLT_REG.10 v76.12,26.5 v76.12,26.49 | v76.5,23.01 C63.1 | v76.5,23.01 78.06,21.46 INDUCTOR_7.2
  Top 0.762: R24.2 v70.26,20.57
  Top 1.016: R24.2 75.01,22.99
  Bottom 0.254: v76.12,26.49 76.5,26.11 v76.5,23.01
  Bottom 0.762: v70.26,20.57 70.03,20.8 70.03,29.21 v70.28,29.46
V_12VNO1_0
  Top 2.54: J5_12VNO1_CONN.2 75.01,13.88 R24.1
V_12VNO2  (via drill 0.35)
  Top 0.254: 12VNO2_VOLT_REG.2 94.78,39.02 93.44,40.37 v92.61,40.37 91.69,41.29 R26.1 | 12VNO2_VOLT_REG.10 v99.31,37.52 | v99.59,34.06 101.25,32.41 INDUCTOR_8.2
  Top 0.762: R27.2 v93.07,31.73
  Top 1.016: R27.2 97.94,34.03 C32.1 v99.59,34.06 C62.1
  Bottom 0.254: v99.59,34.06 99.59,37.24 v99.31,37.52
  Bottom 0.889: v93.07,31.73 92.61,32.18 v92.61,40.37
  pour Top (isolate 0.254): 99.62,34.09 102.72,30.99 109.58,30.99 109.96,31.37 109.96,33.63 109.5,34.09
V_12VNO2_0
  Top 2.54: J6_12VNO2_CONN.2 97.69,28.93 R27.1
V_VLINE
  Top 2.54: R12.2 47.45,45.09 41.12,51.41 41.12,60.91 | R31.2 76.05,60.25 75.64,60.66 | 75.64,60.66 75.62,60.68 63.3,60.68 R18.2 41.38,60.66 41.12,60.91 | R7.2 14.66,49.05 26.41,60.8 | 33.66,60.91 33.63,60.94 26.54,60.94 26.41,60.8 | R5.2 33.66,60.91 | 33.66,60.91 41.12,60.91 | Q2.2 26.41,60.8 | 75.64,60.66 98.98,60.66 R69.2
  pour Top (isolate 0.254, no thermals): 13.18,61.04 13.18,65.66 13.79,66.27 103.63,66.27 104.62,65.28 104.62,60.53 103.78,59.69 14.53,59.69
V_VLINE00
  Top 2.54: J0_VLINE_CONN.2 6.8,49.49 2.49,53.8 R65.2
V_VLINE0
  Top 2.032: R65.1 Q2.3 | Q2.3 11.07,58.52 11.1,58.5 10.1,57.49 9.41,57.49 Q2.3
VC_5VNO1
  Top 0.254: 5VNO1_VOLT_REG.5 R62.2
VC_5VNO2
  Top 0.254: 5VNO2_VOLT_REG.5 R3.2
VC_9VNO1
  Top 0.254: 9VNO1_VOLT_REG.5 R10.2
VC_9VNO2
  Top 0.254: 9VNO2_VOLT_REG.5 59.37,47.62 R16.2
VC_12VNO1
  Top 0.254: 12VNO1_VOLT_REG.5 69.22,26.5 R29.2
VC_12VNO2
  Top 0.254: 12VNO2_VOLT_REG.5 91.55,37.52 R36.2
VIN_5VNO1
  Top 0.254: C58.1 15.09,29.72 14.88,29.92 | 5VNO1_VOLT_REG.13 13.9,24.37 14.41,24.87
  Top 0.762: 14.41,24.87 C58.1
  Top 1.016: R6.2 R7.1 14.88,33.81 14.88,29.92 | 15.09,29.72 C59.1
VIN_5VNO2
  Top 0.254: 5VNO2_VOLT_REG.13 32.88,39.99 | R5.1 33.58,48.75
  Top 0.381: 32.88,39.99 33.58,40.7
  Top 0.762: C1.1 33.58,40.7
  Top 1.016: C2.1 C1.1 33.58,48.75 | R5.1 R4.2
VIN_9VNO1
  Top 0.254: 9VNO1_VOLT_REG.13 44.33,20.66 44.93,21.26 | 44.93,25.35 C5.1
  Top 0.762: 44.93,21.26 44.93,25.35
  Top 1.016: C10.1 C5.1 R12.1 R11.2
VIN_9VNO2
  Top 0.254: 9VNO2_VOLT_REG.13 62.75,49.13 63.3,49.68 | 63.3,53.95 C13.1
  Top 0.762: 63.3,49.68 63.3,53.95
  Top 1.016: C16.1 63.56,54.25 C13.1 R18.1 61.76,58.12 R17.2
VIN_12VNO1
  Top 0.254: 12VNO1_VOLT_REG.13 75.57,28 76.36,28.78
  Top 0.381: C26.1 76.05,32.87
  Top 0.762: C26.1 76.36,32.56 76.36,28.78
  Top 1.016: 76.05,32.87 R31.1 R30.2 | C27.1 C26.1
VIN_12VNO2
  Top 0.254: 12VNO2_VOLT_REG.13 98.46,39.02 98.96,39.52
  Top 0.762: C30.1 98.96,39.52
  Top 1.016: R68.2 R69.1 98.96,47.76 C30.1 C31.1